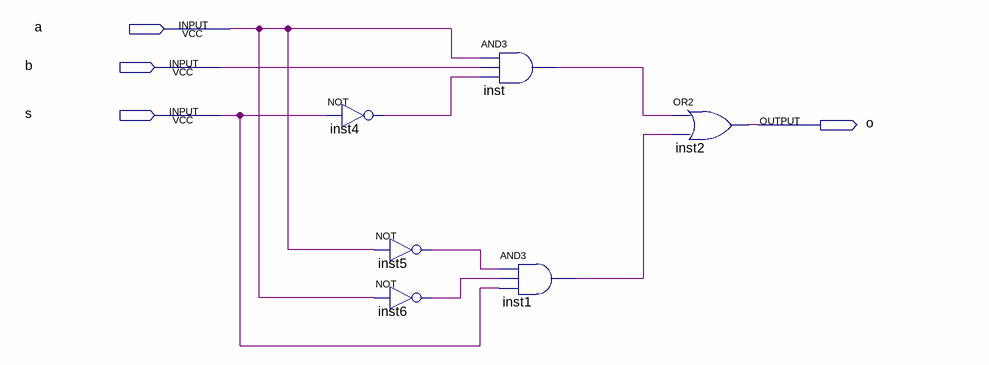
[diagram p0: schematic sheet]
// Quartus schematic overflow.bdf as structural Verilog: 6 symbols, 4 pins
module overflow (
  input  a,
  input  b,
  input  s,
  output o
);

  wire inst1_out, inst4_out, inst5_out, inst6_out, inst_out;

  not inst4 (inst4_out, s);
  not inst5 (inst5_out, a);
  not inst6 (inst6_out, a);
  and inst (inst_out, a, b, inst4_out);
  and inst1 (inst1_out, inst5_out, inst6_out, s);
  or inst2 (o, inst_out, inst1_out);
endmodule
